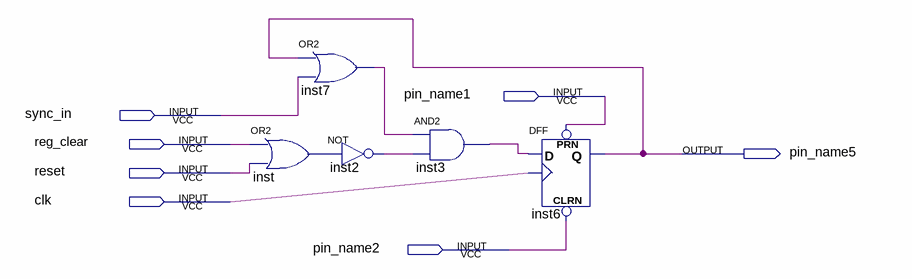
[diagram p0: schematic sheet]
// Quartus schematic Block1.bdf as structural Verilog: 5 symbols, 7 pins
module Block1 (
  input  pin_name1,
  input  sync_in,
  input  reg_clear,
  input  reset,
  input  clk,
  input  pin_name2,
  output pin_name5
);

  wire inst2_out, inst3_out, inst7_out, inst_out;

  or inst (inst_out, reg_clear, reset);
  or inst7 (inst7_out, pin_name5, sync_in);
  not inst2 (inst2_out, inst_out);
  and inst3 (inst3_out, inst7_out, inst2_out);
  DFF inst6 (.CLRN(pin_name2), .CLK(clk), .D(inst3_out), .PRN(pin_name1), .Q(pin_name5));
endmodule
